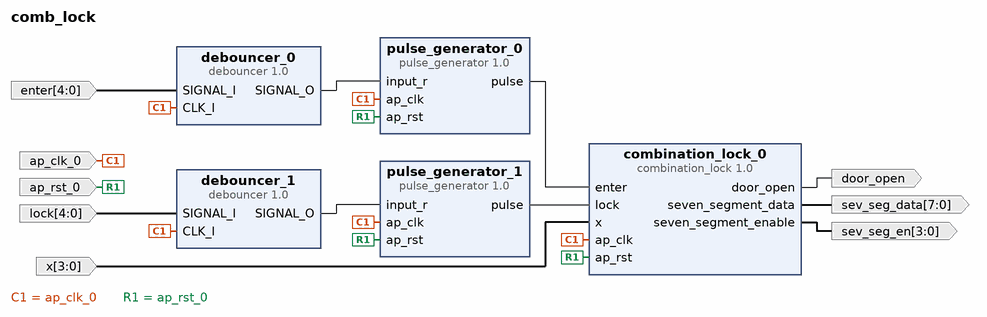
[diagram p0: block diagram of the top level]
# Vivado block design comb_lock, xc7a35tcpg236-1, Vivado 2025.1
create_bd_design comb_lock

create_bd_port -dir I -type clk ap_clk_0
create_bd_port -dir I -type rst ap_rst_0
set_property -dict {CONFIG.POLARITY ACTIVE_HIGH} [get_bd_ports ap_rst_0]
create_bd_port -dir I -from 3 -to 0 -type data x
create_bd_port -dir O -from 7 -to 0 -type data sev_seg_data
create_bd_port -dir O -type data door_open
create_bd_port -dir O -from 3 -to 0 -type data sev_seg_en
create_bd_port -dir I -from 4 -to 0 lock
create_bd_port -dir I -from 4 -to 0 enter

create_bd_cell -type ip -vlnv xilinx.com:hls:combination_lock:1.0 combination_lock_0
create_bd_cell -type ip -vlnv xilinx.com:user:debouncer:1.0 debouncer_0
create_bd_cell -type ip -vlnv xilinx.com:user:debouncer:1.0 debouncer_1
create_bd_cell -type ip -vlnv xilinx.com:hls:pulse_generator:1.0 pulse_generator_0
create_bd_cell -type ip -vlnv xilinx.com:hls:pulse_generator:1.0 pulse_generator_1

# ---- connections ----

connect_bd_net -net SIGNAL_I_0_1 [get_bd_ports lock] [get_bd_pins debouncer_1/SIGNAL_I]
connect_bd_net -net SIGNAL_I_0_2 [get_bd_ports enter] [get_bd_pins debouncer_0/SIGNAL_I]
connect_bd_net -net ap_clk_0_1 [get_bd_ports ap_clk_0] \
  [get_bd_pins combination_lock_0/ap_clk] [get_bd_pins pulse_generator_0/ap_clk] [get_bd_pins pulse_generator_1/ap_clk] \
  [get_bd_pins debouncer_0/CLK_I] [get_bd_pins debouncer_1/CLK_I]
connect_bd_net -net ap_rst_0_1 [get_bd_ports ap_rst_0] \
  [get_bd_pins combination_lock_0/ap_rst] [get_bd_pins pulse_generator_0/ap_rst] [get_bd_pins pulse_generator_1/ap_rst]
connect_bd_net [get_bd_pins combination_lock_0/door_open] [get_bd_ports door_open]
connect_bd_net [get_bd_pins combination_lock_0/seven_segment_data] [get_bd_ports sev_seg_data]
connect_bd_net [get_bd_pins combination_lock_0/seven_segment_enable] [get_bd_ports sev_seg_en]
connect_bd_net [get_bd_pins debouncer_0/SIGNAL_O] [get_bd_pins pulse_generator_0/input_r]
connect_bd_net [get_bd_pins debouncer_1/SIGNAL_O] [get_bd_pins pulse_generator_1/input_r]
connect_bd_net [get_bd_pins pulse_generator_0/pulse] [get_bd_pins combination_lock_0/enter]
connect_bd_net [get_bd_pins pulse_generator_1/pulse] [get_bd_pins combination_lock_0/lock]
connect_bd_net -net x_0_1 [get_bd_ports x] [get_bd_pins combination_lock_0/x]

validate_bd_design
save_bd_design
